# Altium schematic sheet Task.SchDoc
size A4
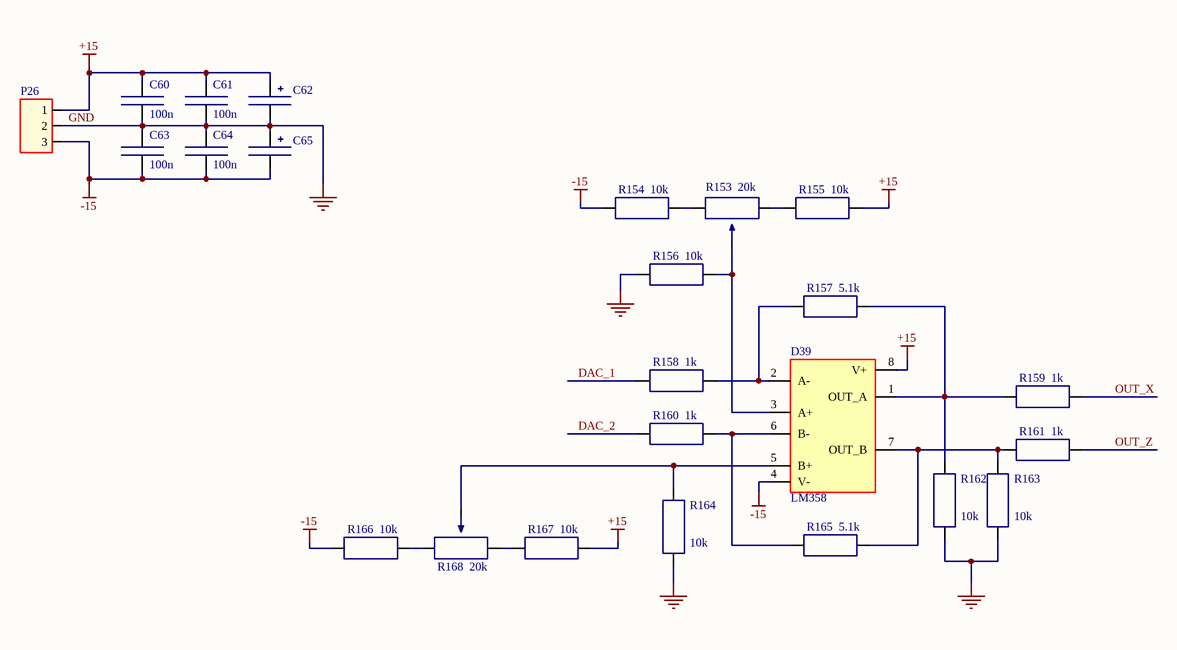
[diagram p0: Task.SchDoc]

## Parts
C60  100n  [C0805]
C61  100n  [C0805]
C62  Capacitor_Polyar  [SMD_El_SizeA]  (value not drawn)
C63  100n  [C0805]
C64  100n  [C0805]
C65  Capacitor_Polyar  [SMD_El_SizeA]  (value not drawn)
D39  LM358  [SOIC-8]
P26  KLS_3_5mm  [KLS_3_5MM]  (value not drawn)
R153  20k  [RES_POT_1]
R154  10k  [R0805]
R155  10k  [R0805]
R156  10k  [R0805]
R157  5.1k  [R0805]
R158  1k  [R0805]
R159  1k  [R0805]
R160  1k  [R0805]
R161  1k  [R0805]
R162  10k  [R0805]
R163  10k  [R0805]
R164  10k  [R0805]
R165  5.1k  [R0805]
R166  10k  [R0805]
R167  10k  [R0805]
R168  20k  [RES_POT_1]

## Nets
+15: C60.1 C61.1 C62.1 D39.8(V+) P26.1 R155.1 R167.1
-15: C63.2 C64.2 C65.2 D39.4(V-) P26.3 R154.2 R166.2
GND: C60.2 C61.2 C62.2 C63.1 C64.1 C65.1 P26.2 R156.2 R162.1 R163.1 R164.2
DAC_1: R158.2
DAC_2: R160.2
OUT_X: R159.1
OUT_Z: R161.1
NetD39_1: D39.1(OUT_A) R157.1 R159.2 R162.2
NetD39_2: D39.2(A-) R157.2 R158.1
NetD39_3: D39.3(A+) R153.3 R156.1
NetD39_5: D39.5(B+) R164.1 R168.3
NetD39_6: D39.6(B-) R160.1 R165.2
NetD39_7: D39.7(OUT_B) R161.2 R163.2 R165.1
NetR153_1: R153.1 R155.2
NetR153_2: R153.2 R154.1
NetR166_1: R166.1 R168.1
NetR167_2: R167.2 R168.2

## Library data of the parts
C60 C61 C63 C64 = C0805
R153 R168 = Res_Pot_1
R154-R167 = R0805